# Altium project Arduino_Due_Shield.PrjPcb
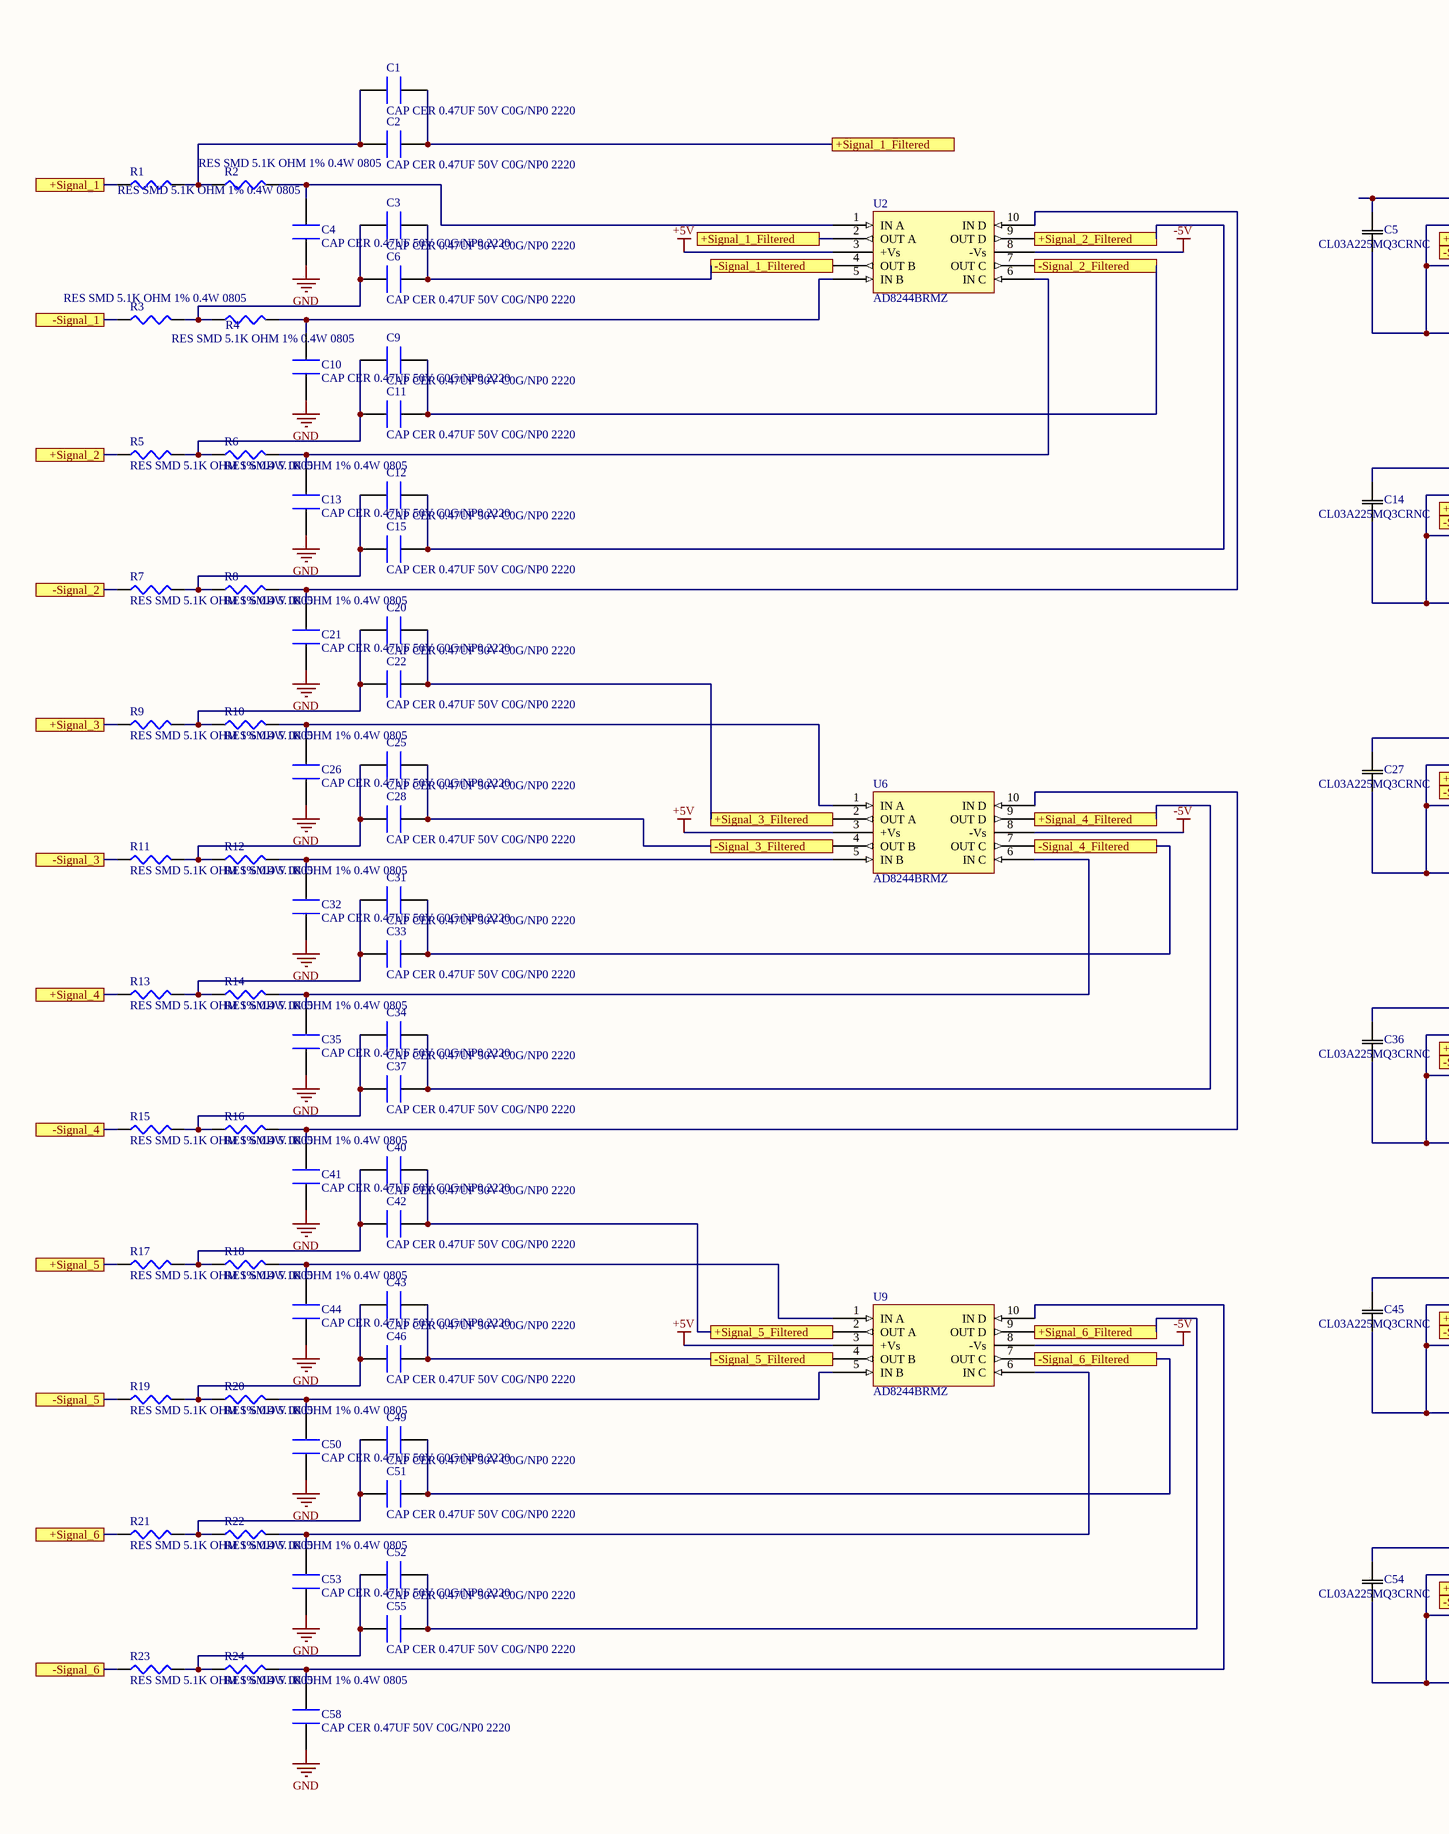
[diagram p0: Shield_Due.SchDoc, left]
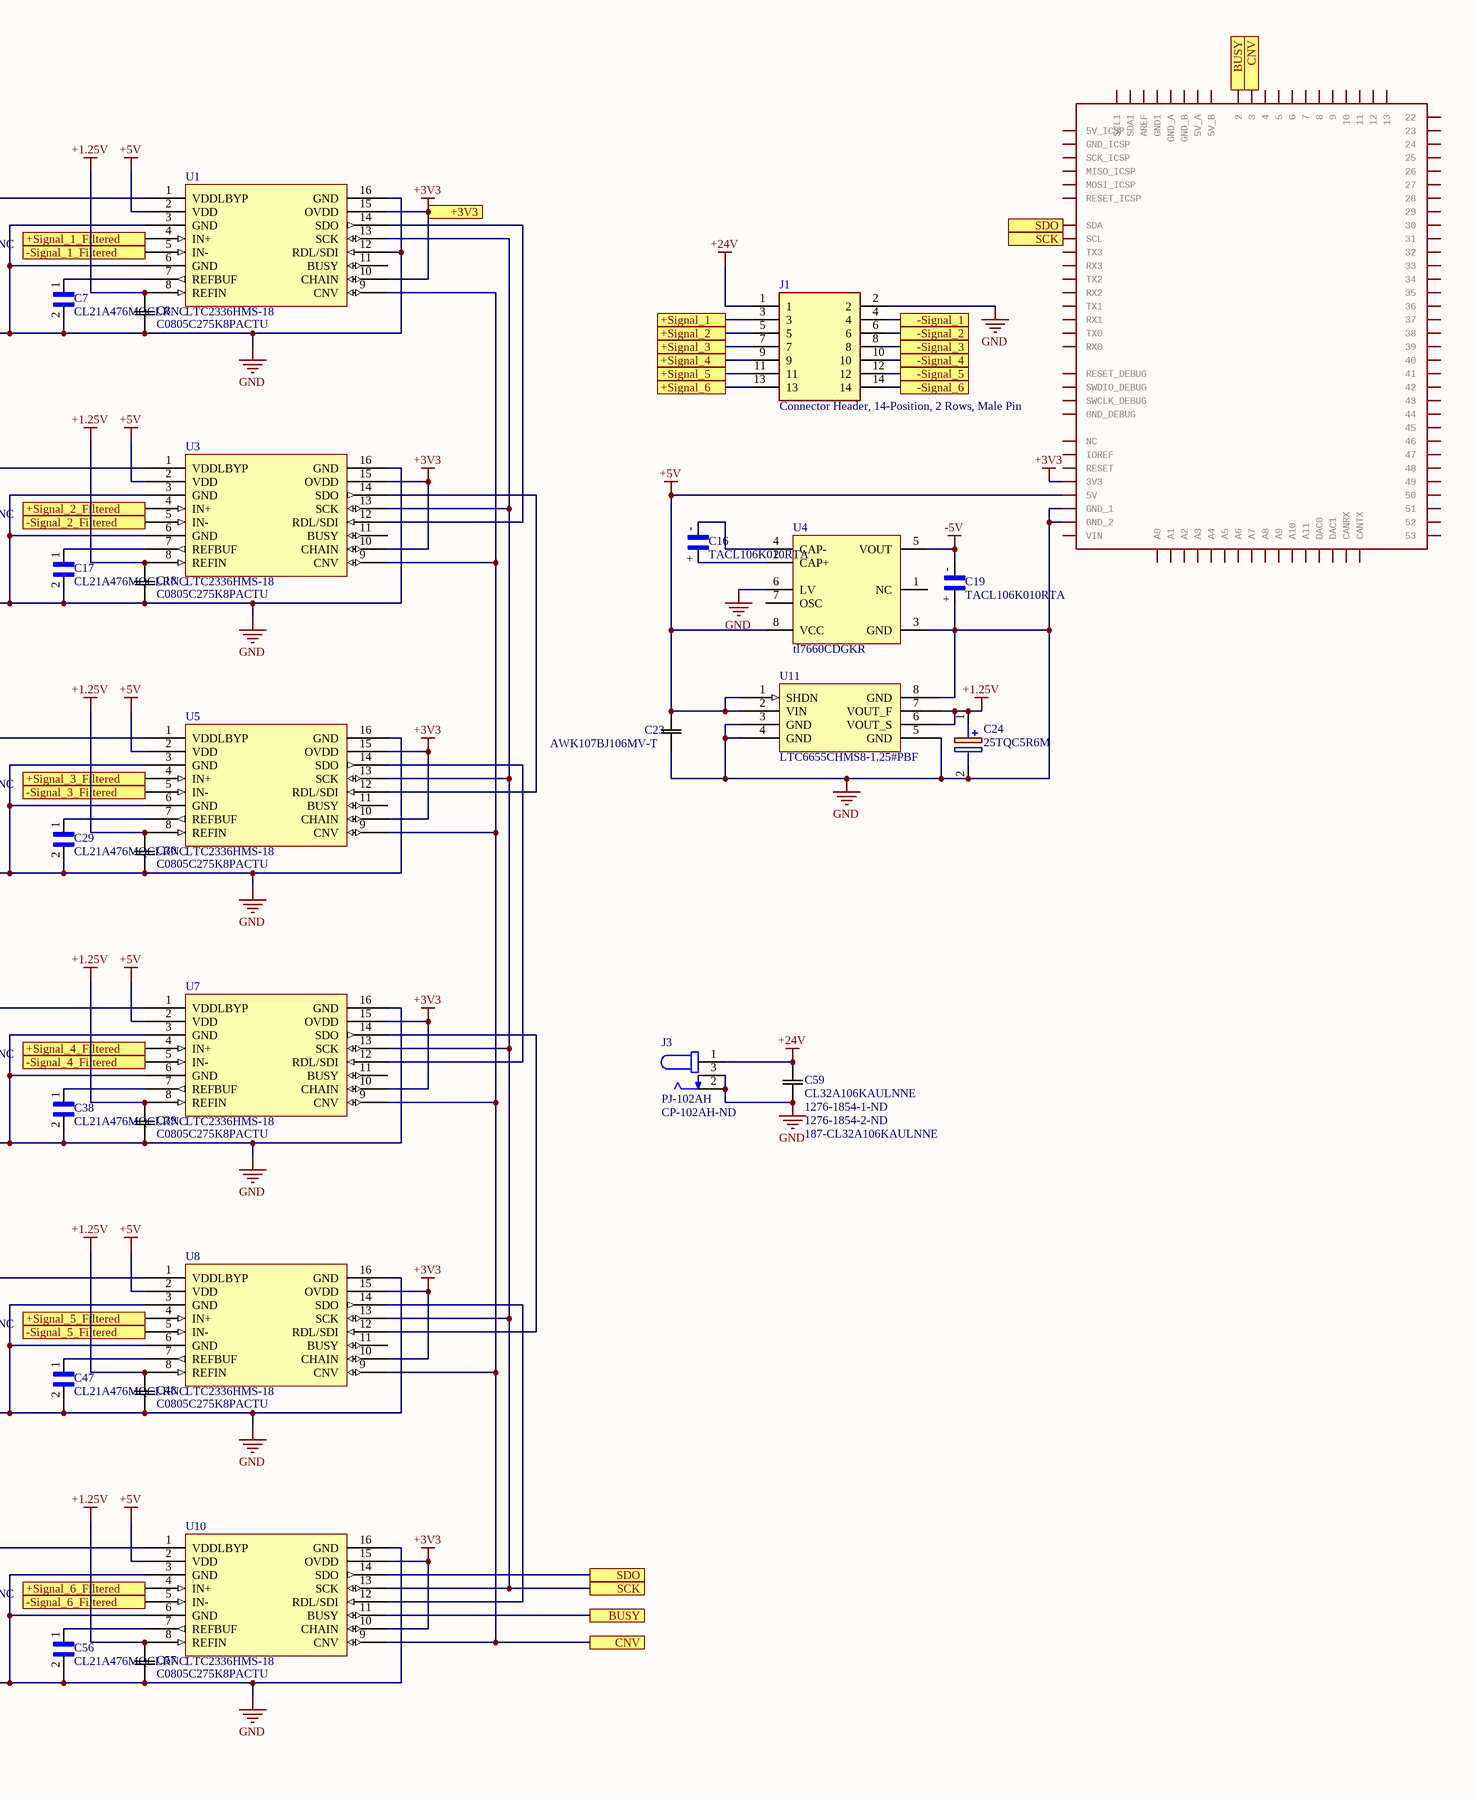
[diagram p1: Shield_Due.SchDoc, right]
CAGE_CODE: ?????; CONTRACT_NUMBER: <CONTRACT NO>; DOC_NO_ASSY_DWG: <ASSY DWG NO>; DOC_NO_BOM: <BOM DOC NO>; DOC_NO_FAB_DWG: <FAB DWG NO>; DOC_NO_SCH_DWG: <SCH DWG NO>; PCB_2_DEC_TOL: +/-.01; PCB_3_DEC_TOL: +/-.010; PCB_ANG_TOL: +/-1/2; PCB_ASSEMBLY_NO: <PCB ASSY NO>; PCB_CHECKER: - -----; PCB_CHECKER_APP_DATE: --/--/----; PCB_DESIGNER: - -----; PCB_DESIGNER_APP_DATE: --/--/----; PCB_DWG_NO: <PCB DWG NO>; PCB_ENGINEER: - -----; PCB_ENGINEER_APP_DATE: --/--/----; PCB_PART_NUMBER: <PCB PN>; PCB_REV: A; SCH_REV: A
1 sheet, 97 parts. Net scope: flat (ports and power ports of the same name join across sheets).
Board file: Shield_Due.PcbDoc

## Sheet Shield_Due.SchDoc
size A2; SheetNumber: 1; SheetTotal: 1

### Parts
C1  CAP CER 0.47UF 50V C0G/NP0 2220  [2220 (5650) Capacitor]
C2  CAP CER 0.47UF 50V C0G/NP0 2220  [2220 (5650) Capacitor]
C3  CAP CER 0.47UF 50V C0G/NP0 2220  [2220 (5650) Capacitor]
C4  CAP CER 0.47UF 50V C0G/NP0 2220  [2220 (5650) Capacitor]
C5  CL03A225MQ3CRNC  [CAP_CL_03_SAM]
C6  CAP CER 0.47UF 50V C0G/NP0 2220  [2220 (5650) Capacitor]
C7  CL21A476MQCLRNC  [CAPC2012X140N]
C8  C0805C275K8PACTU  [CAPC220145_105N_KEM]
C9  CAP CER 0.47UF 50V C0G/NP0 2220  [2220 (5650) Capacitor]
C10  CAP CER 0.47UF 50V C0G/NP0 2220  [2220 (5650) Capacitor]
C11  CAP CER 0.47UF 50V C0G/NP0 2220  [2220 (5650) Capacitor]
C12  CAP CER 0.47UF 50V C0G/NP0 2220  [2220 (5650) Capacitor]
C13  CAP CER 0.47UF 50V C0G/NP0 2220  [2220 (5650) Capacitor]
C14  CL03A225MQ3CRNC  [CAP_CL_03_SAM]
C15  CAP CER 0.47UF 50V C0G/NP0 2220  [2220 (5650) Capacitor]
C16  TACL106K010RTA  [CAPC1608X90]
C17  CL21A476MQCLRNC  [CAPC2012X140N]
C18  C0805C275K8PACTU  [CAPC220145_105N_KEM]
C19  TACL106K010RTA  [CAPC1608X90]
C20  CAP CER 0.47UF 50V C0G/NP0 2220  [2220 (5650) Capacitor]
C21  CAP CER 0.47UF 50V C0G/NP0 2220  [2220 (5650) Capacitor]
C22  CAP CER 0.47UF 50V C0G/NP0 2220  [2220 (5650) Capacitor]
C23  AWK107BJ106MV-T  [AWK107_0306_TAY]
C24  25TQC5R6M  [POSCAP_B1_B1S_B1G_B15G_B2_B2S]
C25  CAP CER 0.47UF 50V C0G/NP0 2220  [2220 (5650) Capacitor]
C26  CAP CER 0.47UF 50V C0G/NP0 2220  [2220 (5650) Capacitor]
C27  CL03A225MQ3CRNC  [CAP_CL_03_SAM]
C28  CAP CER 0.47UF 50V C0G/NP0 2220  [2220 (5650) Capacitor]
C29  CL21A476MQCLRNC  [CAPC2012X140N]
C30  C0805C275K8PACTU  [CAPC220145_105N_KEM]
C31  CAP CER 0.47UF 50V C0G/NP0 2220  [2220 (5650) Capacitor]
C32  CAP CER 0.47UF 50V C0G/NP0 2220  [2220 (5650) Capacitor]
C33  CAP CER 0.47UF 50V C0G/NP0 2220  [2220 (5650) Capacitor]
C34  CAP CER 0.47UF 50V C0G/NP0 2220  [2220 (5650) Capacitor]
C35  CAP CER 0.47UF 50V C0G/NP0 2220  [2220 (5650) Capacitor]
C36  CL03A225MQ3CRNC  [CAP_CL_03_SAM]
C37  CAP CER 0.47UF 50V C0G/NP0 2220  [2220 (5650) Capacitor]
C38  CL21A476MQCLRNC  [CAPC2012X140N]
C39  C0805C275K8PACTU  [CAPC220145_105N_KEM]
C40  CAP CER 0.47UF 50V C0G/NP0 2220  [2220 (5650) Capacitor]
C41  CAP CER 0.47UF 50V C0G/NP0 2220  [2220 (5650) Capacitor]
C42  CAP CER 0.47UF 50V C0G/NP0 2220  [2220 (5650) Capacitor]
C43  CAP CER 0.47UF 50V C0G/NP0 2220  [2220 (5650) Capacitor]
C44  CAP CER 0.47UF 50V C0G/NP0 2220  [2220 (5650) Capacitor]
C45  CL03A225MQ3CRNC  [CAP_CL_03_SAM]
C46  CAP CER 0.47UF 50V C0G/NP0 2220  [2220 (5650) Capacitor]
C47  CL21A476MQCLRNC  [CAPC2012X140N]
C48  C0805C275K8PACTU  [CAPC220145_105N_KEM]
C49  CAP CER 0.47UF 50V C0G/NP0 2220  [2220 (5650) Capacitor]
C50  CAP CER 0.47UF 50V C0G/NP0 2220  [2220 (5650) Capacitor]
C51  CAP CER 0.47UF 50V C0G/NP0 2220  [2220 (5650) Capacitor]
C52  CAP CER 0.47UF 50V C0G/NP0 2220  [2220 (5650) Capacitor]
C53  CAP CER 0.47UF 50V C0G/NP0 2220  [2220 (5650) Capacitor]
C54  CL03A225MQ3CRNC  [CAP_CL_03_SAM]
C55  CAP CER 0.47UF 50V C0G/NP0 2220  [2220 (5650) Capacitor]
C56  CL21A476MQCLRNC  [CAPC2012X140N]
C57  C0805C275K8PACTU  [CAPC220145_105N_KEM]
C58  CAP CER 0.47UF 50V C0G/NP0 2220  [2220 (5650) Capacitor]
C59  CL32A106KAULNNE  Supplier Part Number 1: 1276-1854-1-ND  Supplier Part Number 2: 1276-1854-2-ND  Supplier Part Number 3: 187-CL32A106KAULNNE  [CAP_CL32_SAM]
J1  Connector Header, 14-Position, 2 Rows, Male Pin  [TE_1-770973-0]
J3  PJ-102AH  Supplier Part Number 1: CP-102AH-ND  [CUI_PJ-102AH]
MCU1  DUE(NORMAL)  [DUE(NORMAL)]  (value not drawn)
R1  RES SMD 5.1K OHM 1% 0.4W 0805  [0805 Resistor]
R2  RES SMD 5.1K OHM 1% 0.4W 0805  [0805 Resistor]
R3  RES SMD 5.1K OHM 1% 0.4W 0805  [0805 Resistor]
R4  RES SMD 5.1K OHM 1% 0.4W 0805  [0805 Resistor]
R5  RES SMD 5.1K OHM 1% 0.4W 0805  [0805 Resistor]
R6  RES SMD 5.1K OHM 1% 0.4W 0805  [0805 Resistor]
R7  RES SMD 5.1K OHM 1% 0.4W 0805  [0805 Resistor]
R8  RES SMD 5.1K OHM 1% 0.4W 0805  [0805 Resistor]
R9  RES SMD 5.1K OHM 1% 0.4W 0805  [0805 Resistor]
R10  RES SMD 5.1K OHM 1% 0.4W 0805  [0805 Resistor]
R11  RES SMD 5.1K OHM 1% 0.4W 0805  [0805 Resistor]
R12  RES SMD 5.1K OHM 1% 0.4W 0805  [0805 Resistor]
R13  RES SMD 5.1K OHM 1% 0.4W 0805  [0805 Resistor]
R14  RES SMD 5.1K OHM 1% 0.4W 0805  [0805 Resistor]
R15  RES SMD 5.1K OHM 1% 0.4W 0805  [0805 Resistor]
R16  RES SMD 5.1K OHM 1% 0.4W 0805  [0805 Resistor]
R17  RES SMD 5.1K OHM 1% 0.4W 0805  [0805 Resistor]
R18  RES SMD 5.1K OHM 1% 0.4W 0805  [0805 Resistor]
R19  RES SMD 5.1K OHM 1% 0.4W 0805  [0805 Resistor]
R20  RES SMD 5.1K OHM 1% 0.4W 0805  [0805 Resistor]
R21  RES SMD 5.1K OHM 1% 0.4W 0805  [0805 Resistor]
R22  RES SMD 5.1K OHM 1% 0.4W 0805  [0805 Resistor]
R23  RES SMD 5.1K OHM 1% 0.4W 0805  [0805 Resistor]
R24  RES SMD 5.1K OHM 1% 0.4W 0805  [0805 Resistor]
U1  LTC2336HMS-18  [TSSOP50P490X110-16N]
U2  AD8244BRMZ  [AD8244BRMZ]
U3  LTC2336HMS-18  [TSSOP50P490X110-16N]
U4  tl7660CDGKR  [DGK0008A_L]
U5  LTC2336HMS-18  [TSSOP50P490X110-16N]
U6  AD8244BRMZ  [AD8244BRMZ]
U7  LTC2336HMS-18  [TSSOP50P490X110-16N]
U8  LTC2336HMS-18  [TSSOP50P490X110-16N]
U9  AD8244BRMZ  [AD8244BRMZ]
U10  LTC2336HMS-18  [TSSOP50P490X110-16N]
U11  LTC6655CHMS8-1.25#PBF  [TSOP65P490X110-8N]

### Ports
+3V3, +Signal_1, +Signal_1_Filtered, +Signal_2, +Signal_2_Filtered, +Signal_3, +Signal_3_Filtered, +Signal_4, +Signal_4_Filtered, +Signal_5, +Signal_5_Filtered, +Signal_6, +Signal_6_Filtered, -Signal_1, -Signal_1_Filtered, -Signal_2, -Signal_2_Filtered, -Signal_3, -Signal_3_Filtered, -Signal_4, -Signal_4_Filtered, -Signal_5, -Signal_5_Filtered, -Signal_6, -Signal_6_Filtered, BUSY, CNV, SCK, SDO

### Nets
+1.25V: C8.2 C18.2 C24.1(+) C30.2 C39.2 C48.2 C57.2 U1.8(REFIN) U3.8(REFIN) U5.8(REFIN) U7.8(REFIN) U8.8(REFIN) U10.8(REFIN) U11.6(VOUT_S) U11.7(VOUT_F)
+3V3: MCU1.3V3 U1.10(CHAIN) U1.15(OVDD) U3.10(CHAIN) U3.15(OVDD) U5.10(CHAIN) U5.15(OVDD) U7.10(CHAIN) U7.15(OVDD) U8.10(CHAIN) U8.15(OVDD) U10.10(CHAIN) U10.15(OVDD) ; port +3V3
+5V: C23.2 MCU1.5V U1.2(VDD) U2.3(+Vs) U3.2(VDD) U4.8(VCC) U5.2(VDD) U6.3(+Vs) U7.2(VDD) U8.2(VDD) U9.3(+Vs) U10.2(VDD) U11.1(SHDN) U11.2(VIN)
+24V: C59.1 J1.1 J3.1
-5V: C19.- U2.8(-Vs) U4.5(VOUT) U6.8(-Vs) U9.8(-Vs)
GND: C4.2 C5.1 C7.2 C8.1 C10.2 C13.2 C14.1 C17.2 C18.1 C19.+ C21.2 C23.1 C24.2(-) C26.2 C27.1 C29.2 C30.1 C32.2 C35.2 C36.1 C38.2 C39.1 C41.2 C44.2 C45.1 C47.2 C48.1 C50.2 C53.2 C54.1 C56.2 C57.1 C58.2 C59.2 J1.2 J3.2 J3.3 MCU1.GND_1 MCU1.GND_2 U1.3(GND) U1.6(GND) U1.12(RDL/SDI) U1.16(GND) U3.3(GND) U3.6(GND) U3.16(GND) U4.3(GND) U4.6(LV) U5.3(GND) U5.6(GND) U5.16(GND) U7.3(GND) U7.6(GND) U7.16(GND) U8.3(GND) U8.6(GND) U8.16(GND) U10.3(GND) U10.6(GND) U10.16(GND) U11.3(GND) U11.4(GND) U11.5(GND) U11.8(GND)
NetC1_1: C1.1 C2.1 U1.4(IN+) U2.2(OUT_A) ; port +Signal_1_Filtered
NetC1_2: C1.2 C2.2 R1.2 R2.1
NetC3_1: C3.1 C6.1 U1.5(IN-) U2.4(OUT_B) ; port -Signal_1_Filtered
NetC3_2: C3.2 C6.2 R3.2 R4.1
NetC4_1: C4.1 R2.2 U2.1(IN_A)
NetC5_2: C5.2 U1.1(VDDLBYP)
NetC7_1: C7.1 U1.7(REFBUF)
NetC9_1: C9.1 C11.1 R5.2 R6.1
NetC9_2: C9.2 C11.2 U2.7(OUT_C) U3.5(IN-) ; port -Signal_2_Filtered
NetC10_1: C10.1 R4.2 U2.5(IN_B)
NetC12_1: C12.1 C15.1 R7.2 R8.1
NetC12_2: C12.2 C15.2 U2.9(OUT_D) U3.4(IN+) ; port +Signal_2_Filtered
NetC13_1: C13.1 R6.2 U2.6(IN_C)
NetC14_2: C14.2 U3.1(VDDLBYP)
NetC16_+: C16.+ U4.2(CAP+)
NetC16_-: C16.- U4.4(CAP-)
NetC17_1: C17.1 U3.7(REFBUF)
NetC20_1: C20.1 C22.1 R9.2 R10.1
NetC20_2: C20.2 C22.2 U5.4(IN+) U6.2(OUT_A) ; port +Signal_3_Filtered
NetC21_1: C21.1 R8.2 U2.10(IN_D)
NetC25_1: C25.1 C28.1 R11.2 R12.1
NetC25_2: C25.2 C28.2 U5.5(IN-) U6.4(OUT_B) ; port -Signal_3_Filtered
NetC26_1: C26.1 R10.2 U6.1(IN_A)
NetC27_2: C27.2 U5.1(VDDLBYP)
NetC29_1: C29.1 U5.7(REFBUF)
NetC31_1: C31.1 C33.1 R13.2 R14.1
NetC31_2: C31.2 C33.2 U6.7(OUT_C) U7.5(IN-) ; port -Signal_4_Filtered
NetC32_1: C32.1 R12.2 U6.5(IN_B)
NetC34_1: C34.1 C37.1 R15.2 R16.1
NetC34_2: C34.2 C37.2 U6.9(OUT_D) U7.4(IN+) ; port +Signal_4_Filtered
NetC35_1: C35.1 R14.2 U6.6(IN_C)
NetC36_2: C36.2 U7.1(VDDLBYP)
NetC38_1: C38.1 U7.7(REFBUF)
NetC40_1: C40.1 C42.1 R17.2 R18.1
NetC40_2: C40.2 C42.2 U8.4(IN+) U9.2(OUT_A) ; port +Signal_5_Filtered
NetC41_1: C41.1 R16.2 U6.10(IN_D)
NetC43_1: C43.1 C46.1 R19.2 R20.1
NetC43_2: C43.2 C46.2 U8.5(IN-) U9.4(OUT_B) ; port -Signal_5_Filtered
NetC44_1: C44.1 R18.2 U9.1(IN_A)
NetC45_2: C45.2 U8.1(VDDLBYP)
NetC47_1: C47.1 U8.7(REFBUF)
NetC49_1: C49.1 C51.1 R21.2 R22.1
NetC49_2: C49.2 C51.2 U9.7(OUT_C) U10.5(IN-) ; port -Signal_6_Filtered
NetC50_1: C50.1 R20.2 U9.5(IN_B)
NetC52_1: C52.1 C55.1 U9.9(OUT_D) U10.4(IN+) ; port +Signal_6_Filtered
NetC52_2: C52.2 C55.2 R23.2 R24.1
NetC53_1: C53.1 R22.2 U9.6(IN_C)
NetC54_2: C54.2 U10.1(VDDLBYP)
NetC56_1: C56.1 U10.7(REFBUF)
NetC58_1: C58.1 R24.2 U9.10(IN_D)
NetJ1_3: J1.3 R1.1 ; port +Signal_1
NetJ1_4: J1.4 R3.1 ; port -Signal_1
NetJ1_5: J1.5 R5.1 ; port +Signal_2
NetJ1_6: J1.6 R7.1 ; port -Signal_2
NetJ1_7: J1.7 R9.1 ; port +Signal_3
NetJ1_8: J1.8 R11.1 ; port -Signal_3
NetJ1_9: J1.9 R13.1 ; port +Signal_4
NetJ1_10: J1.10 R15.1 ; port -Signal_4
NetJ1_11: J1.11 R17.1 ; port +Signal_5
NetJ1_12: J1.12 R19.1 ; port -Signal_5
NetJ1_13: J1.13 R21.1 ; port +Signal_6
NetJ1_14: J1.14 R23.1 ; port -Signal_6
NetMCU1_2: MCU1.2 U10.11(BUSY) ; port BUSY
NetMCU1_3: MCU1.3 U1.9(CNV) U3.9(CNV) U5.9(CNV) U7.9(CNV) U8.9(CNV) U10.9(CNV) ; port CNV
NetMCU1_SCL: MCU1.SCL U1.13(SCK) U3.13(SCK) U5.13(SCK) U7.13(SCK) U8.13(SCK) U10.13(SCK) ; port SCK
NetMCU1_SDA: MCU1.SDA U10.14(SDO) ; port SDO
NetU1_14: U1.14(SDO) U3.12(RDL/SDI)
NetU3_14: U3.14(SDO) U5.12(RDL/SDI)
NetU5_14: U5.14(SDO) U7.12(RDL/SDI)
NetU7_14: U7.14(SDO) U8.12(RDL/SDI)
NetU8_14: U8.14(SDO) U10.12(RDL/SDI)

Not connected (* = marked no-connect by the designer): MCU1 4 5 5V_A 5V_B 5V_ICSP 6 7 8 9 10 11 12 13 22 23 24 25 26 27 28 29 30 31 32 33 34 35 36 37 38 39 40 41 42 43 44 45 46 47 48 49 50 51 52 53 A0 A1 A2 A3 A4 A5 A6 A7 A8 A9 A10 A11 AREF CANRX CANTX DAC0 DAC1 GND1 GND_A GND_B GND_DEBUG GND_ICSP IOREF MISO_ICSP MOSI_ICSP NC RESET RESET_DEBUG RESET_ICSP RX0 RX1 RX2 RX3 SCK_ICSP SCL1 SDA1 SWCLK_DEBUG SWDIO_DEBUG TX0 TX1 TX2 TX3 VIN; U1 11(BUSY); U3 11(BUSY); U4 1(NC) 7(OSC); U5 11(BUSY); U7 11(BUSY); U8 11(BUSY)

### Library data of the parts
C1-C4 C6 C9-C13 C15 C20-C22 C25 C26 C28 C31-C35 C37 C40-C44 C46 C49-C53 C55 C58 = CAP CER 0.47UF 50V C0G/NP0 2220: Cap Ceramic 0.47uF 50V C0G 5% SMD 2220 125°C Embossed Plastic T/R; Manufacturer: KEMET; Manufacturer Part Number: C2220C474J5GACAUTO; Capacitance: 470nF; Supplier 1: Digi-Key; Supplier Part Number 1: 399-C2220C474J5GACAUTOCT-ND; RoHS: Yes; Category: Ceramic Capacitors; Stock 1: 950; Pricing 1: 1=4.64000, 10=3.74400, 50=3.21940, 100=2.92000, 500=2.17128 (USD); Case/Package: 2220; Dielectric Material: Ceramic; Voltage Rating (DC): 50V; Tolerance: 5%; Lead Free: Lead Free; RoHS Compliant: Yes; ComponentLink1URL: http://www.farnell.com/datasheets/2747618.pdf?src-supplier=Farnell; ComponentLink1Description: http://www.farnell.com/datasheets/2747618.pdf?src-supplier=Farnell; Supplier 2: Digi-Key; Supplier Part Number 2: 399-C2220C474J5GACAUTODKR-ND; Stock 2: 950; Pricing 2: 1=4.64000, 10=3.74400, 50=3.21940, 100=2.92000, 500=2.17128 (USD); Supplier 3: Mouser; Supplier Part Number 3: 80-C2220C474J5GAUTO; Stock 3: 1000; Pricing 3: 1=4.64000, 10=3.75000, 50=3.22000, 100=2.91000, 1000=2.48000, 10000=2.48000 (USD)
C5 C14 C27 C36 C45 C54 = CL03A225MQ3CRNC: CL03 Series 0201 2.2 uF 6.3 V X5R ±20% Tolerance Multilayer Ceramic Capacitor; Mfr_Name: Samsung; Type: DEV; Capacitance: 2.2uF; Voltage Rating: 6.3V; Copyright: Copyright (C) 2022 Ultra Librarian. All rights reserved.; Manufacturer_Part_Number: CL03A225MQ3CRNC; Digi-Key_Part_Number_1: 1276-6870-2-ND; Digi-Key_Part_Number_2: 1276-6870-1-ND; Digi-Key_Part_Number_3: 1276-6870-6-ND; RefDes: RefDes; Supplier 1: Digi-Key; Supplier Part Number 1: 1276-6870-1-ND; Manufacturer: Samsung; Manufacturer Part Number: CL03A225MQ3CRNC; RoHS: Yes; Category: Ceramic Capacitors; Stock 1: 667406; Pricing 1: 1=0.27000, 10=0.18500, 50=0.11080, 100=0.09360, 500=0.06406, 1000=0.05667, 2500=0.05421, 5000=0.04928 (USD); Mount: Surface Mount; Case/Package: 0201; Case Code (Metric): 0603; Case Code (Imperial): 0201; Min Operating Temperature: -55°C; Max Operating Temperature: 85°C; Packaging: Tape and Reel; Tolerance: 20%; Dielectric: X5R; Series: CL; Construction: Flat; Length: 0.6mm; Width: 0.012inch; Height: 0.3mm; Thickness: 0.013inch; Depth: 0.3mm; Radiation Hardening: No; RoHS Compliant: Yes; ComponentLink1URL: https://datasheet.ciiva.com/26838/getdatasheetpartid-745303-26838096.pdf?src-supplier=Verical; ComponentLink1Description: https://datasheet.ciiva.com/26838/getdatasheetpartid-745303-26838096.pdf?src-supplier=Verical; Supplier 2: Digi-Key; Supplier Part Number 2: 1276-6870-6-ND; Stock 2: 667406; Pricing 2: 1=0.27000, 10=0.18500, 50=0.11080, 100=0.09360, 500=0.06406, 1000=0.05667, 2500=0.05421, 5000=0.04928 (USD); Supplier 3: Digi-Key; Supplier Part Number 3: 1276-6870-2-ND; Stock 3: 650000; Pricing 3: 10000=0.04682, 20000=0.04435 (USD); Supplier 4: Mouser; Supplier Part Number 4: 187-CL03A225MQ3CRNC; Stock 4: 295762; Pricing 4: 1=0.29000, 10=0.13300, 50=0.13300, 100=0.10000, 1000=0.06100, 10000=0.04900 (USD)
C7 C17 C29 C38 C47 C56 = CL21A476MQCLRNC: Cap Ceramic 47uF 6.3V X5R 20% SMD 0805 85°C Paper T/R; MF: Samsung; Package: 0805 Samsung; MP: CL21A476MQCLRNC; Value: *; SnapEDA_Link: https://www.snapeda.com/parts/CL21A476MQCLRNC/Samsung/view-part/3598165/?ref=snap; Availability: Unavailable; Price: None; DigiKey-Purchase-URL: https://snapeda.com/shop?store=DigiKey&id=3598165; Supplier 1: Digi-Key; Supplier Part Number 1: 1276-2420-1-ND; Manufacturer: Samsung; Manufacturer Part Number: CL21A476MQCLRNC; RoHS: Yes; Category: Ceramic Capacitors; Stock 1: 98057; Pricing 1: 1=0.49000, 10=0.34100, 50=0.23900, 100=0.20480, 500=0.15362, 1000=0.12973 (USD); Mount: Surface Mount; Case/Package: 0805; Case Code (Metric): 2012; Case Code (Imperial): 0805; Contact Plating: Tin; Min Operating Temperature: -55°C; Max Operating Temperature: 85°C; Tolerance: 20%; Packaging: Tape and Reel; Package Quantity: 4000; Capacitance: 47uF; Voltage Rating: 6.3V; Dielectric: X5R; Termination: Wraparound; Series: CL; Construction: Flat; Length: 2mm; Width: 0.049inch; Thickness: 0.037inch; Depth: 1.25mm; Lead Free: Lead Free; RoHS Compliant: Yes; ComponentLink1URL: https://datasheet.ciiva.com/25723/cl21a476mqclrnc-25723991.pdf?src-supplier=Digi-Key; ComponentLink1Description: https://datasheet.ciiva.com/25723/cl21a476mqclrnc-25723991.pdf?src-supplier=Digi-Key; Supplier 2: Digi-Key; Supplier Part Number 2: 1276-2420-6-ND; Stock 2: 98057; Pricing 2: 1=0.49000, 10=0.34100, 50=0.23900, 100=0.20480, 500=0.15362, 1000=0.12973 (USD); Supplier 3: Digi-Key; Supplier Part Number 3: 1276-2420-2-ND; Stock 3: 98057; Pricing 3: 4000=0.11607, 8000=0.10924 (USD); Supplier 4: Mouser; Supplier Part Number 4: 187-CL21A476MQCLRNC; Stock 4: 323; Pricing 4: 1=0.50000, 10=0.28500, 50=0.28500, 100=0.21700, 1000=0.13700, 10000=0.10800 (USD)
C8 C18 C30 C39 C48 C57 = C0805C275K8PACTU: 0805 C 2.7uF Ceramic Multilayer Capacitor; 10 VDC; +85degC; X5R Dielec; +/-10%; Mfr_Name: Kemet; Type: DEV; Tolerance: 10%; Voltage Rating: 10V; Dissipation Factor: 5%; Copyright: Copyright (C) 2022 Ultra Librarian. All rights reserved.; Manufacturer_Part_Number: C0805C275K8PACTU; Digi-Key_Part_Number_1: 399-3127-1-ND; Digi-Key_Part_Number_2: 399-3127-2-ND; Digi-Key_Part_Number_3: 399-3127-6-ND; RefDes: RefDes; Supplier 1: Digi-Key; Supplier Part Number 1: 399-C0805C275K8PAC7800CT-ND; Manufacturer: KEMET; Manufacturer Part Number: C0805C275K8PACTU; RoHS: Yes; Category: Ceramic Capacitors; Stock 1: 7603; Pricing 1: 1=0.51000, 10=0.36000, 50=0.27220, 100=0.23700, 500=0.17556, 1000=0.14923 (USD); Mount: Surface Mount,PCB; Case/Package: 0805; Case Code (Metric): 2012; Case Code (Imperial): 0805; Dielectric Material: Ceramic; Min Operating Temperature: -55°C; Max Operating Temperature: 85°C; Capacitance: 2.7uF; Dielectric: X5R; Packaging: Tape and Reel; Package Quantity: 1; Voltage Rating (DC): 10V; Termination: SMD/SMT; Voltage: 10V; Series: C; Construction: Flat; Length: 2mm; Width: 0.049inch; Height: 3mm; Depth: 1.25mm; Thickness: 0.041inch; Lead Pitch: 0.75mm; Radiation Hardening: No; REACH SVHC: No SVHC; Lead Free: Lead Free; RoHS Compliant: Yes; ComponentLink1URL: http://www.mouser.com/ds/2/212/KEM_C1006_X5R_SMD-1103249.pdf?src-supplier=Mouser; ComponentLink1Description: http://www.mouser.com/ds/2/212/KEM_C1006_X5R_SMD-1103249.pdf?src-supplier=Mouser; ComponentLink2URL: http://components.arrow.com/part/dataview/40912422S7467711N7429?src-supplier=Arrow+Electronics; ComponentLink2Description: http://components.arrow.com/part/dataview/40912422S7467711N7429?src-supplier=Arrow+Electronics; ComponentLink3URL: http://uk.rs-online.com/webdocs/13da/0900766b813da6d7.pdf?src-supplier=RSComponents; ComponentLink3Description: http://uk.rs-online.com/webdocs/13da/0900766b813da6d7.pdf?src-supplier=RSComponents; ComponentLink4URL: http://uk.rs-online.com/webdocs/13da/0900766b813da6d8.pdf?src-supplier=RSComponents; ComponentLink4Description: http://uk.rs-online.com/webdocs/13da/0900766b813da6d8.pdf?src-supplier=RSComponents; ComponentLink5URL: https://www.alliedelec.com/m/d/7f88201dbaab65c95b0b8234579261a3.pdf?src-supplier=Allied+Electronics; ComponentLink5Description: https://www.alliedelec.com/m/d/7f88201dbaab65c95b0b8234579261a3.pdf?src-supplier=Allied+Electronics; ComponentLink6URL: https://www.alliedelec.com/m/d/fc0aaf5de6140bfa85cbf42aaccfae41.pdf?src-supplier=Allied+Electronics; ComponentLink6Description: https://www.alliedelec.com/m/d/fc0aaf5de6140bfa85cbf42aaccfae41.pdf?src-supplier=Allied+Electronics; ComponentLink7URL: https://search.kemet.com/component-edge/download/datasheet/C0805C275K8PACTU.pdf?src-supplier=Digi-Key; ComponentLink7Description: https://search.kemet.com/component-edge/download/datasheet/C0805C275K8PACTU.pdf?src-supplier=Digi-Key; ComponentLink8URL: https://api.kemet.com/component-edge/download/datasheet/C0805C275K8PACTU.pdf?src-supplier=Digi-Key; ComponentLink8Description: https://api.kemet.com/component-edge/download/datasheet/C0805C275K8PACTU.pdf?src-supplier=Digi-Key; ComponentLink9URL: http://capacitoredge.kemet.com/capedge2/DataSheet?pn=C0805C275K8PAC7800&src-supplier=Avnet; ComponentLink9Description: http://capacitoredge.kemet.com/capedge2/DataSheet?pn=C0805C275K8PAC7800&src-supplier=Avnet; ComponentLink10URL: http://capacitoredge.kemet.com/capedge2/DataSheet?pn=C0805C275K8PAC7800&src-supplier=Avnet+Europe; ComponentLink10Description: http://capacitoredge.kemet.com/capedge2/DataSheet?pn=C0805C275K8PAC7800&src-supplier=Avnet+Europe; Supplier 2: Digi-Key; Supplier Part Number 2: 399-C0805C275K8PAC7800DKR-ND; Stock 2: 7603; Pricing 2: 1=0.51000, 10=0.36000, 50=0.27220, 100=0.23700, 500=0.17556, 1000=0.14923 (USD); Supplier 3: Digi-Key; Supplier Part Number 3: 399-C0805C275K8PAC7800TR-ND; Stock 3: 4000; Pricing 3: 4000=0.11970, 8000=0.11172 (USD); Supplier 4: Mouser; Supplier Part Number 4: 80-C0805C275K8P; Stock 4: 6516; Pricing 4: 1=0.51000, 10=0.27300, 50=0.27300, 100=0.22400, 1000=0.14400, 10000=0.11100 (USD)
C16 C19 = TACL106K010RTA: Cap Tant Solid 10uF 10V L CASE 10% (1.6 X 0.85 X 0.85mm) SMD 1608-10 7.5 Ohm 125°C Plastic T/R; Manufacturer: Kyocera AVX; Dielectric Material: Tantalum; ESR (Equivalent Series Resistance): 7.5R; Leakage Current: 1uA; Dissipation Factor: 20%; Polarity: Polar; Package: None; Price: None; Value: *; MP: TACL106K010RTA; Availability: Unavailable; Supplier 1: Digi-Key; Supplier Part Number 1: 478-TACL106K010RTACT-ND; Manufacturer Part Number: TACL106K010RTA; RoHS: Yes; Category: Tantalum Capacitors; Stock 1: 3500; Pricing 1: 1=2.54000, 10=2.05600, 50=1.79400, 100=1.56980, 500=1.19600, 1000=1.04650 (USD); Case/Package: Conformal Coated; Number of Pins: 2; Case Code (Imperial): 0603; Case Code (Metric): 1608; Min Operating Temperature: -55°C; Max Operating Temperature: 125°C; Capacitance: 10uF; Tolerance: 10%; Package Quantity: 3500; Voltage Rating: 10V; Packaging: Tape and Reel; Voltage Rating (DC): 10V; Termination: SMD/SMT; Voltage: 10V; Series: TAC; Construction: Flat; Length: 1.6mm; Width: 0.85mm; Height: 0.85mm; Lead Pitch: 0.55mm; Depth: 0.85mm; Radiation Hardening: No; RoHS Compliant: Yes; ComponentLink1URL: https://datasheet.ciiva.com/11219/tac-11219455.pdf?src-supplier=Avnet; ComponentLink1Description: https://datasheet.ciiva.com/11219/tac-11219455.pdf?src-supplier=Avnet; ComponentLink2URL: https://datasheet.ciiva.com/12907/tac-12907781.pdf?src-supplier=Mouser; ComponentLink2Description: https://datasheet.ciiva.com/12907/tac-12907781.pdf?src-supplier=Mouser; ComponentLink3URL: https://datasheet.ciiva.com/14598/70001310-14598278.pdf?src-supplier=Allied+Electronics; ComponentLink3Description: https://datasheet.ciiva.com/14598/70001310-14598278.pdf?src-supplier=Allied+Electronics; Supplier 2: Digi-Key; Supplier Part Number 2: 478-TACL106K010RTADKR-ND; Stock 2: 3500; Pricing 2: 1=2.54000, 10=2.05600, 50=1.79400, 100=1.56980, 500=1.19600, 1000=1.04650 (USD); Supplier 3: Digi-Key; Supplier Part Number 3: 478-TACL106K010RTATR-ND; Stock 3: 3500; Pricing 3: 3500=1.00913 (USD)
C23 = AWK107BJ106MV-T: Multilayer Ceramic Capacitor 10uF 4V 20% 0306 Emboss T/R; Mfr_Name: Taiyo Yuden; Type: DEV; Copyright: Copyright (C) 2022 Ultra Librarian. All rights reserved.; Manufacturer_Part_Number: AWK107BJ106MV-T; Digi-Key_Part_Number_1: 587-5159-1-ND; Digi-Key_Part_Number_2: 587-5159-2-ND; Digi-Key_Part_Number_3: 587-5159-6-ND; RefDes: RefDes; Supplier 1: Digi-Key; Supplier Part Number 1: 587-5159-1-ND; Manufacturer: Taiyo Yuden; Manufacturer Part Number: AWK107BJ106MV-T; RoHS: Yes; Category: Ceramic Capacitors; Stock 1: 5653; Pricing 1: 1=0.53000, 10=0.37700, 50=0.28480, 100=0.24810, 500=0.18376, 1000=0.15620 (USD); Mount: Surface Mount; Case/Package: 0306; Case Code (Imperial): 0306; Case Code (Metric): 0816; Min Operating Temperature: -55°C; Max Operating Temperature: 85°C; Packaging: Cut Tape; Capacitance: 10uF; Tolerance: 20%; Voltage Rating: 4V; RoHS Compliant: Yes; ComponentLink1URL: https://ds.yuden.co.jp/TYCOMPAS/ut/detail?pn=AWK107BJ106MV-T &amp;u=M&src-supplier=Digi-Key; ComponentLink1Description: https://ds.yuden.co.jp/TYCOMPAS/ut/detail?pn=AWK107BJ106MV-T &amp;u=M&src-supplier=Digi-Key; ComponentLink2URL: http://ds.yuden.co.jp/TYCOMPAS/ut/detail.do?productNo=AWK107BJ106MV-T&amp;fileName=AWK107BJ106MV-T_SS&amp;mode=specSheetDownload&src-supplier=Digi-Key; ComponentLink2Description: http://ds.yuden.co.jp/TYCOMPAS/ut/detail.do?productNo=AWK107BJ106MV-T&amp;fileName=AWK107BJ106MV-T_SS&amp;mode=specSheetDownload&src-supplier=Digi-Key; Supplier 2: Digi-Key; Supplier Part Number 2: 587-5159-6-ND; Stock 2: 5653; Pricing 2: 1=0.53000, 10=0.37700, 50=0.28480, 100=0.24810, 500=0.18376, 1000=0.15620 (USD); Supplier 3: Digi-Key; Supplier Part Number 3: 587-5159-2-ND; Stock 3: 4000; Pricing 3: 4000=0.13783 (USD); Supplier 4: Mouser; Supplier Part Number 4: 963-AWK107BJ106MV-T; Stock 4: 3076; Pricing 4: 1=0.51000, 10=0.27300, 50=0.27300, 100=0.23800, 1000=0.15000, 10000=0.13100 (USD)
C24 = 25TQC5R6M: Cap Tant Solid 5.6uF 25V B2 CASE 20% (3.5 X 2.8 X 1.9mm) SMD 3528, B2 0.1 Ohm 105°C Embossed T/R; Manufacturer_Name: Panasonic; ESR (Equivalent Series Resistance): 100mR; Ripple Current: 800mA; Leakage Current: 42uA; Polarity: Polar; Life (Hours): 2000Hour; Dissipation Factor: 10%; Datasheet Link: http://industrial.panasonic.com/cdbs/www-data/pdf/AAA8000/AAA8000C62.pdf; Manufacturer_Part_Number: 25TQC5R6M; Supplier 1: Digi-Key; Supplier Part Number 1: P16518CT-ND; Manufacturer: Panasonic; Manufacturer Part Number: 25TQC5R6M; RoHS: Yes; Category: Tantalum Capacitors; Stock 1: 7710; Pricing 1: 1=2.01000, 10=1.58300, 50=1.37220, 100=1.18740, 500=0.89718, 1000=0.79162 (USD); Mount: Surface Mount; Case/Package: 1411; Number of Pins: 2; Case Code (Metric): 3528; Case Code (Imperial): 1411; Min Operating Temperature: -55°C; Max Operating Temperature: 105°C; Package Quantity: 2000; Packaging: Tape and Reel; Capacitance: 5.6uF; Tolerance: 20%; Voltage Rating: 25V; Voltage Rating (DC): 25V; Termination: SMD/SMT; Voltage: 25V; Features: General Purpose; Length: 3.5mm; Width: 0.11inch; Height: 1.9mm; Height - Seated (Max): 0.079inch; Depth: 2.8mm; Radiation Hardening: No; REACH SVHC: No SVHC; Lead Free: Lead Free; RoHS Compliant: Yes; ComponentLink1URL: https://datasheet.ciiva.com/48675/aaa8000ce14-48675021.pdf?src-supplier=Avnet; ComponentLink1Description: https://datasheet.ciiva.com/48675/aaa8000ce14-48675021.pdf?src-supplier=Avnet; ComponentLink2URL: https://datasheet.ciiva.com/48543/tqc-series-eng-tds-48543112.pdf?src-supplier=Distrelec; ComponentLink2Description: https://datasheet.ciiva.com/48543/tqc-series-eng-tds-48543112.pdf?src-supplier=Distrelec; ComponentLink3URL: https://datasheet.ciiva.com/22745/1734368-22745228.pdf?src-supplier=Element14; ComponentLink3Description: https://datasheet.ciiva.com/22745/1734368-22745228.pdf?src-supplier=Element14; ComponentLink4URL: https://datasheet.ciiva.com/25785/1734368-25785141.pdf?src-supplier=Farnell; ComponentLink4Description: https://datasheet.ciiva.com/25785/1734368-25785141.pdf?src-supplier=Farnell; Supplier 2: Digi-Key; Supplier Part Number 2: P16518DKR-ND; Stock 2: 7710; Pricing 2: 1=2.01000, 10=1.58300, 50=1.37220, 100=1.18740, 500=0.89718, 1000=0.79162 (USD); Supplier 3: Digi-Key; Supplier Part Number 3: P16518TR-ND; Stock 3: 6000; Pricing 3: 2000=0.73885 (USD); Supplier 4: Mouser; Supplier Part Number 4: 667-25TQC5R6M; Stock 4: 2467; Pricing 4: 1=1.77000, 10=1.27000, 50=1.27000, 100=1.08000, 1000=0.72000, 10000=0.67900 (USD)
C59 = CL32A106KAULNNE: Cap Ceramic 10uF 25V X5R 10% SMD 1210 85°C Embossed T/R; Mfr_Name: Samsung; Type: DEV; Copyright: Copyright (C) 2022 Ultra Librarian. All rights reserved.; Manufacturer_Part_Number: CL32A106KAULNNE; Digi-Key_Part_Number_1: 1276-1854-2-ND; Digi-Key_Part_Number_2: 1276-1854-1-ND; Digi-Key_Part_Number_3: 1276-1854-6-ND; RefDes: RefDes; Supplier 1: Digi-Key; Manufacturer: Samsung; Manufacturer Part Number: CL32A106KAULNNE; RoHS: Yes; Category: Ceramic Capacitors; Stock 1: 1126; Pricing 1: 1=0.36000, 10=0.24500, 50=0.16360, 100=0.13910, 500=0.09816, 1000=0.08589 (USD); Mount: Surface Mount; Case/Package: 1210; Case Code (Metric): 3225; Case Code (Imperial): 1210; Min Operating Temperature: -55°C; Max Operating Temperature: 85°C; Capacitance: 10uF; Tolerance: 10%; Dielectric: X5R; Package Quantity: 1; Packaging: Tape and Reel; Voltage Rating: 25V; Series: CL; Construction: Flat; Length: 3.2mm; Width: 0.098inch; Height: 1.8mm; Depth: 2.5mm; Thickness: 0.079inch; Radiation Hardening: No; Lead Free: Lead Free; RoHS Compliant: Yes; ComponentLink1URL: https://datasheet.ciiva.com/25792/cl32a106kaulnne-25792896.pdf?src-supplier=Digi-Key; ComponentLink1Description: https://datasheet.ciiva.com/25792/cl32a106kaulnne-25792896.pdf?src-supplier=Digi-Key; ComponentLink2URL: https://datasheet.ciiva.com/16362/cl05b104kq5nnnc-16362286.pdf?src-supplier=Future+Electronics; ComponentLink2Description: https://datasheet.ciiva.com/16362/cl05b104kq5nnnc-16362286.pdf?src-supplier=Future+Electronics; Supplier 2: Digi-Key; Stock 2: 2794000; Pricing 2: 2000=0.08180, 4000=0.07566 (USD); Supplier 3: Mouser; Stock 3: 13193; Pricing 3: 1=0.38000, 10=0.26100, 50=0.26100, 100=0.14900, 500=0.10500, 1000=0.09200, 2000=0.08700, 4000=0.08000, 10000=0.07600 (USD)
J1 = 1-770973-0: Connector Header, 14-Position, 2 Rows, Male Pin, PCB, White, Mate-N-Lok Series; Manufacturer: TE Connectivity; MF: {'manufacturer': 'TE Connectivity'}; Number of Terminals/Pins: 14; Current Rating: 9.5A; Insulation Resistance: 100MR; Connector System: Wire-to-Board; Mating Alignment: Yes (With); PCB Mount Alignment: No (Without); PCB Mount Retention: With; Max Voltage Rating (AC): 600V; Number of Ports: 1; Test Voltage: 1.5kV; Circuit Application: Power; VDE Tested: Yes; Pitch: 0.162inch; Row Spacing: 0.163inch; Plating Thickness: 8.89um; PCB Thickness: 1.57inch; Approvals: CSA; Value: *; Availability: Unavailable; Package: None; MP: 1-770973-0; Price: None; Supplier 1: Digi-Key; Supplier Part Number 1: A32482-ND; Manufacturer Part Number: 1-770973-0; RoHS: Yes; Category: Power Connectors; Stock 1: 583; Pricing 1: 1=6.69000, 10=6.05100, 100=5.29790, 500=4.46140, 1000=3.90372 (USD); Mount: Through Hole,Board; Color: White; Contact Plating: Tin; Contact Material: Brass; Housing Material: Nylon; Housing Color: White; Min Operating Temperature: -67°C; Max Operating Temperature: 221°C; Packaging: Bag; Package Quantity: 200; Termination: Solder; Orientation: Right Angle; Series: Mini-Universal MATE-N-LOK; Number of Rows: 2; Contact Gender: Male; Number of Positions: 14; Number of Contacts: 14; Connector Type: Pin; Mating Retention: Yes (With); Contact Current Rating: 9.5A; Contact Type: Male Pin; Number of Poles: 14; Fastening Type: Ramp; Voltage Rating: 600V; Contact Retention: No (Without); Number of Power Positions: 14; Sealable: No (Without); Strain Relief: No (Without); Length: 30.56mm; Width: 12.7mm; Height: 11.86mm; Radiation Hardening: No; REACH SVHC: Unknown; Flammability Rating: UL94 V-0; RoHS Compliant: Yes; ComponentLink1URL: https://datasheet.ciiva.com/19460/1963239-19460794.pdf?src-supplier=Jameco; ComponentLink1Description: https://datasheet.ciiva.com/19460/1963239-19460794.pdf?src-supplier=Jameco; ComponentLink2URL: https://datasheet.ciiva.com/1111/eng-cd-770973-g-1111842.pdf?src-supplier=Element14; ComponentLink2Description: https://datasheet.ciiva.com/1111/eng-cd-770973-g-1111842.pdf?src-supplier=Element14; ComponentLink3URL: https://datasheet.ciiva.com/710/eng-cd-770973-h-710742.pdf?src-supplier=Digi-Key; ComponentLink3Description: https://datasheet.ciiva.com/710/eng-cd-770973-h-710742.pdf?src-supplier=Digi-Key; ComponentLink4URL: https://datasheet.ciiva.com/16654/eng-cs-82181-softshell-high-density-0408-16654873.pdf?src-supplier=Avnet+Europe; ComponentLink4Description: https://datasheet.ciiva.com/16654/eng-cs-82181-softshell-high-density-0408-16654873.pdf?src-supplier=Avnet+Europe; Supplier 2: Newark; Supplier Part Number 2: 52K3387; Stock 2: 272; Pricing 2: 1=6.19000, 10=5.42000, 25=5.24000, 50=5.07000, 100=4.89000, 250=4.38000 (USD); Supplier 3: Mouser; Supplier Part Number 3: 571-1-770973-0; Stock 3: 1677; Pricing 3: 1=6.37000, 10=5.58000, 50=5.58000, 100=5.05000, 200=4.51000, 600=4.24000, 1000=3.71000, 2600=3.53000, 5000=3.45000, 10000=3.36000 (USD)
J3 = PJ-102AH: 2.0 x 6.5 mm, 5.0 A, Horizontal, Through Hole, Tapered Pins, Dc Power Jack Connector; Manufacturer: CUI; MF: CUI Devices; Gender: Male; Shielding: Unshielded; Current Rating: 5A; Voltage Rating: 24V; Insulation Resistance: 50MR; Number of Conductors: 2; Digi-Key_Part_Number: CP-102AH-ND; CUI_purchase_URL: https://www.cuidevices.com/product/interconnect/connectors/dc-power-connectors/jacks/pj-102ah?utm_source=snapeda.com&utm_medium=referral&utm_campaign=snapedaBOM; SnapEDA_Link: https://www.snapeda.com/parts/PJ-102AH/CUI%20Devices/view-part/228264/?ref=snap; Package: None; Value: *; Digi-Key_Purchase_URL: https://www.digikey.com/product-detail/en/cui-devices/PJ-102AH/CP-102AH-ND/408448?utm_source=snapeda&utm_medium=aggregator&utm_campaign=symbol; MP: PJ-102AH; Supplier 1: Digi-Key; Manufacturer Part Number: PJ-102AH; RoHS: Yes; Category: Connectors; Mount: Through Hole; Color: Black; Contact Material: Copper; Contact Plating: Nickel; Housing Color: Black; Housing Material: Thermoplastic; Min Operating Temperature: -25°C; Max Operating Temperature: 85°C; Package Quantity: 280; Termination: Through Hole; Connector Type: Jack; Contact Gender: Male; Series: -; Orientation: Horizontal; Packaging: Bulk; Diameter: 2.1mm; Lead Free: Lead Free; Flammability Rating: UL94 V-0; RoHS Compliant: Yes; ComponentLink1URL: http://www.mouser.com/ds/2/670/PJ-102AH-524179.pdf?src-supplier=Mouser; ComponentLink1Description: http://www.mouser.com/ds/2/670/PJ-102AH-524179.pdf?src-supplier=Mouser; ComponentLink2URL: https://www.cui.com/product/resource/digikeypdf/pj-102ah.pdf?src-supplier=Digi-Key; ComponentLink2Description: https://www.cui.com/product/resource/digikeypdf/pj-102ah.pdf?src-supplier=Digi-Key; ComponentLink3URL: http://www.cui.com/Product/Resource/FuturePDF/PJ-102AH.pdf?src-supplier=Future+Electronics; ComponentLink3Description: http://www.cui.com/Product/Resource/FuturePDF/PJ-102AH.pdf?src-supplier=Future+Electronics
MCU1 = DUE(NORMAL): Mcu, Arduino Due, 32-BIT Cortex- M3 Arm, 96MHZ, 256K, 50K, 5 Spi; Manufacturer Part Number: A000062; GateName_1: G$1; Evaluation Kit: Yes; Number of Bits: 32; SymbolName_1: DUE(NORMAL); LibraryName: DUElib130425; DeviceSetName: DUE(NORMAL); Package: DUE(NORMAL); Supplier 1: Digi-Key; Supplier Part Number 1: 1050-1049-ND; Manufacturer: Arduino; RoHS: Yes; Category: Embedded Processors and Controllers; Stock 1: 7059; Pricing 1: 1=40.30000 (USD); Case/Package: Module; Weight: 0.09lb; Package Quantity: 1; Core Architecture: ARM; Series: AT91SAM3; Length: 4.5inch; Width: 2inch; Height: 0.05inch; REACH SVHC: Unknown; ComponentLink1URL: https://datasheet.ciiva.com/12069/arduinodue-216811-12069710.pdf?src-supplier=Mouser; ComponentLink1Description: https://datasheet.ciiva.com/12069/arduinodue-216811-12069710.pdf?src-supplier=Mouser; ComponentLink2URL: https://datasheet.ciiva.com/14100/due-eng-tds-14100428.pdf?src-supplier=Distrelec; ComponentLink2Description: https://datasheet.ciiva.com/14100/due-eng-tds-14100428.pdf?src-supplier=Distrelec; ComponentLink3URL: https://datasheet.ciiva.com/6205/arduinoduebrd-web-6205279.pdf?src-supplier=Digi-Key; ComponentLink3Description: https://datasheet.ciiva.com/6205/arduinoduebrd-web-6205279.pdf?src-supplier=Digi-Key; ComponentLink4URL: https://datasheet.ciiva.com/19455/2170222-19455450.pdf?src-supplier=Jameco; ComponentLink4Description: https://datasheet.ciiva.com/19455/2170222-19455450.pdf?src-supplier=Jameco; ComponentLink5URL: https://datasheet.ciiva.com/20168/73-4445-20168553.pdf?src-supplier=Rapid+Electronics; ComponentLink5Description: https://datasheet.ciiva.com/20168/73-4445-20168553.pdf?src-supplier=Rapid+Electronics; ComponentLink6URL: https://datasheet.ciiva.com/6810/1682211-6810793.pdf?src-supplier=Newark; ComponentLink6Description: https://datasheet.ciiva.com/6810/1682211-6810793.pdf?src-supplier=Newark; ComponentLink7URL: https://datasheet.ciiva.com/7647/1682211-7647597.pdf?src-supplier=Element14; ComponentLink7Description: https://datasheet.ciiva.com/7647/1682211-7647597.pdf?src-supplier=Element14; Supplier 2: Mouser; Supplier Part Number 2: 782-A000062; Stock 2: 901; Pricing 2: 1=40.30000, 10=40.30000, 50=40.30000, 100=40.30000, 1000=40.30000, 10000=40.30000 (USD)
R1-R24 = RES SMD 5.1K OHM 1% 0.4W 0805: Res Thick Film 0805 5.1kOhm 1% 2/5W ±100ppm/K Molded Paper T/R; Manufacturer: Vishay Dale; Manufacturer Part Number: RCS08055K10FKEA; Resistance: 5.1kR; Max Power Dissipation: 400mW; Temperature Coefficient: 100ppm/°C; Supplier 1: Digi-Key; Supplier Part Number 1: 541-RCS08055K10FKEACT-ND; RoHS: Yes; Category: Chip SMD Resistors; Stock 1: 3307; Pricing 1: 1=0.26000, 10=0.21800, 100=0.08510, 1000=0.03560, 2500=0.03264 (USD); Case/Package: 0805; Min Operating Temperature: -55°C; Max Operating Temperature: 155°C; Package Quantity: 5000; Packaging: Tape and Reel; Resistor Type: Thick Film; Number of Terminations: 2; Tolerance: 1%; Features: Automotive AEC-Q200; Length: 0.079inch; Width: 0.049inch; Height: 0.02inch; ComponentLink1URL: http://www.vishay.com/docs/20065/rcse3.pdf?src-supplier=Digi-Key; ComponentLink1Description: http://www.vishay.com/docs/20065/rcse3.pdf?src-supplier=Digi-Key; Supplier 2: Digi-Key; Supplier Part Number 2: 541-RCS08055K10FKEADKR-ND; Stock 2: 3307; Pricing 2: 1=0.26000, 10=0.21800, 100=0.08510, 1000=0.03560, 2500=0.03264 (USD); Supplier 3: Mouser; Supplier Part Number 3: 71-RCS08055K10FKEA; Stock 3: 1182; Pricing 3: 1=0.26000, 10=0.21800, 50=0.21800, 100=0.08600, 1000=0.03600, 10000=0.03400 (USD)
U1 U3 U5 U7 U8 U10 = LTC2336HMS-18: 1-Channel Single ADC SAR 250ksps 18-bit Serial Automotive 16-Pin MSOP Tube; Manufacturer: Analog Devices / Linear Technology; Manufacturer Part Number: LTC2336HMS-18#PBF; Number of Bits: 18; Nominal Supply Current: 5.5mA; Min Supply Voltage: 4.75V; Max Supply Voltage: 5.25V; Number of Inputs: 1; Sampling Rate: 250000S/s; Interface: SPI; Resolution: 18b; ComponentLink3Description: https://datasheet.ciiva.com/28464/1753492-28464969.pdf?src-supplier=Element14; Category: Analog to Digital Converters (ADCs); ComponentLink2URL: https://datasheet.ciiva.com/29654/43771-29654171.pdf?src-supplier=Digi-Key; Number of A/D Converters: 1; Case/Package: MSOP; Min Operating Temperature: -40°C; Packaging: Rail/Tube; ComponentLink1URL: https://datasheet.ciiva.com/31394/1753492-31394758.pdf?src-supplier=Farnell; Pricing 1: 1=51.57000, 10=48.11400, 25=46.09720, 100=44.84700 (USD); ComponentLink3URL: https://datasheet.ciiva.com/28464/1753492-28464969.pdf?src-supplier=Element14; REACH SVHC: No SVHC; ComponentLink1Description: https://datasheet.ciiva.com/31394/1753492-31394758.pdf?src-supplier=Farnell; Stock 1: 51; Number of Pins: 16; Max Operating Temperature: 125°C; Package Quantity: 37; RoHS Compliant: Yes; ComponentLink2Description: https://datasheet.ciiva.com/29654/43771-29654171.pdf?src-supplier=Digi-Key; RoHS: Yes; Supplier 1: Digi-Key; Supplier Part Number 1: 505-LTC2336HMS-18#PBF-ND
U2 U6 U9 = AD8244BRMZ: Op Amp Quad Low Power Amplifier R-R O/P ±18V/36V 10-Pin MSOP Tube; Manufacturer: Analog Devices; Min Supply Voltage: 3V; Max Supply Voltage: 36V; Min Dual Supply Voltage: 1.5V; Max Dual Supply Voltage: 18V; Voltage Gain: 0dB; Number of Circuits: 4; Slew Rate: 0.8V/µs; -3db Bandwidth: 3MHz; Input Bias Current: 0.5pA; Input Offset Voltage (Vos): 350uV; Operating Supply Current: 180uA; Output Current per Channel: 8mA; Common Mode Rejection Ratio: 61.8dB; Input Capacitance: 3.3pF; Nominal Supply Current: 2.5mA; Power Supply Rejection Ratio (PSRR): 90dB; Settling Time: 18us; Bandwidth: 3.6MHz; Max Frequency: 1kHz; Supplier 1: Digi-Key; Manufacturer Part Number: AD8244BRMZ; RoHS: Yes; Category: Amplifiers - Op Amps, Buffer, Instrumentation; Stock 1: 3; Pricing 1: 1=7.39000, 10=6.67700, 25=6.36680, 100=5.52830, 250=5.27984, 500=4.83450 (USD); Mount: Surface Mount; Case/Package: MSOP; Number of Pins: 10; Min Operating Temperature: -40°C; Max Operating Temperature: 85°C; Packaging: Rail/Tube; Gain Bandwidth Product: 3MHz; Quiescent Current: 180uA; Number of Amplifiers: 4; Length: 3.1mm; Width: 3.1mm; Height: 0.95mm; Lead Free: Contains Lead; REACH SVHC: No SVHC; ComponentLink1URL: https://datasheet.ciiva.com/29970/ad8244-29970485.pdf?src-supplier=Avnet; ComponentLink1Description: https://datasheet.ciiva.com/29970/ad8244-29970485.pdf?src-supplier=Avnet; Supplier 2: Mouser; Stock 2: 351; Pricing 2: 1=7.40000, 10=6.68000, 50=6.36000, 100=5.52000, 1000=4.39000, 10000=4.39000 (USD); Supplier 3: RSComponents; Stock 3: 500; Pricing 3: 10=5.95000, 20=5.56500 (GBP); Supplier Part Number 2: 584-AD8244BRMZ; Supplier Part Number 1: 505-AD8244BRMZ-ND; Supplier Part Number 3: 1831998P
U4 = TI-7660-8: CMOS Voltage Converter 8-VSSOP -40 to 85; Manufacturer: Texas Instruments; Synchronous Rectifier: No; Number of Outputs: 1; Max Input Voltage: 10V; Output Type: Adjustable; Quiescent Current: 110uA; Nominal Supply Current: 120uA; Output Voltage: 20V; Switching Frequency: 9kHz; Min Supply Voltage: 1.5V; Output Current: 20uA; Logic Function: Inverting; ComponentLink2URL: https://datasheet.ciiva.com/2025/tl7660-2025569.pdf?src-supplier=Digi-Key; Stock 4: 2412; Category: Voltage Regulators - Switching; Radiation Hardening: No; Number of Channels: 1; Stock 5: 1398; ComponentLink1Description: https://datasheet.ciiva.com/15114/getdatasheetpartid-256695-15114098.pdf?src-supplier=Verical; Stock 2: 3670; Series: -; Lead Free: Lead Free; RoHS: Yes; Pricing 3: 2500=1.00450 (USD); Weight: 0.000935oz; Pricing 1: 1=1.79000, 10=1.61200, 25=1.52120, 100=1.29600, 250=1.21688, 500=1.06476, 1000=1.00450 (USD); Min Operating Temperature: -40°C; Packaging: Tape and Reel; Supply Current: 120uA; ComponentLink3Description: https://datasheet.ciiva.com/2025/tl7660-2025570.pdf?src-supplier=Digi-Key; Pricing 5: 1=1.79000, 10=1.62000, 25=1.53000, 50=1.53000, 100=1.30000, 250=1.22000, 500=1.07000, 1000=0.88300, 10000=0.88300 (USD); Manufacturer Part Number: TL7660CDGKR; Package Quantity: 1; Stock 1: 3670; Max Operating Temperature: 125°C; Contact Plating: Gold; Pricing 2: 1=1.79000, 10=1.61200, 25=1.52120, 100=1.29600, 250=1.21688, 500=1.06476, 1000=1.00450 (USD); ComponentLink1URL: https://datasheet.ciiva.com/15114/getdatasheetpartid-256695-15114098.pdf?src-supplier=Verical; Width: 3mm; ComponentLink3URL: https://datasheet.ciiva.com/2025/tl7660-2025570.pdf?src-supplier=Digi-Key; Max Supply Voltage: 10V; ComponentLink2Description: https://datasheet.ciiva.com/2025/tl7660-2025569.pdf?src-supplier=Digi-Key; Stock 3: 2500; ComponentLink4URL: https://datasheet.ciiva.com/2025/tl7660-2025571.pdf?src-supplier=Digi-Key; ComponentLink4Description: https://datasheet.ciiva.com/2025/tl7660-2025571.pdf?src-supplier=Digi-Key; RoHS Compliant: Yes; Number of Pins: 8; Pricing 4: 1=1.72270, 10=1.54570, 25=1.47060, 100=1.22500, 250=1.13670, 500=0.99630, 1000=0.81540 (USD); Case/Package: VSSOP; Supplier 1: Digi-Key; Supplier Part Number 1: 296-TL7660CDGKRCT-ND; Supplier 2: Digi-Key; Supplier Part Number 2: 296-TL7660CDGKRDKR-ND; Supplier 3: Digi-Key; Supplier Part Number 3: 296-TL7660CDGKRTR-ND; Supplier 4: Arrow Electronics; Supplier Part Number 4: TL7660CDGKR; Supplier 5: Mouser; Supplier Part Number 5: 595-TL7660CDGKR
U11 = LTC6655: V-Ref Precision 1.25V 5mA Automotive 8-Pin MSOP (test to see if this pushes to cloud); Manufacturer: Analog Devices / Linear Technology; Number of Channels: 1; Quiescent Current: 7mA; Reference Type: Series; Tolerance: 0.05%; Temperature Coefficient: 5ppm/°C; Supplier Part Number 1: 584-C6655CHMS81.25PF; Nominal Supply Current: 5mA; ComponentLink2URL: https://datasheet.ciiva.com/14152/ltc6655-eng-ds-14152023.pdf?src-supplier=Distrelec; ComponentLink2Description: https://datasheet.ciiva.com/14152/ltc6655-eng-ds-14152023.pdf?src-supplier=Distrelec; Manufacturer Part Number: LTC6655CHMS8-1.25#PBF; Number of Pins: 8; ComponentLink1Description: https://datasheet.ciiva.com/2006/28576-2006051.pdf?src-supplier=Digi-Key; Min Operating Temperature: -40°C; Output Current: 5mA; RoHS: Yes; ComponentLink1URL: https://datasheet.ciiva.com/2006/28576-2006051.pdf?src-supplier=Digi-Key; Output Voltage: 1.25V; Series: -; Max Operating Temperature: 125°C; Package Quantity: 50; Stock 1: 586; Pricing 1: 1=9.85000, 10=8.73000, 50=8.32000, 100=7.22000, 250=6.90000, 1000=6.90000, 10000=6.90000 (USD); Max Output Voltage: 1.25V; Case/Package: MSOP; Supply Current: 5mA; Packaging: Rail/Tube; Mount: Surface Mount; RoHS Compliant: Yes; Category: Voltage Regulators - Linear; Supplier 1: Mouser